# Altium schematic sheet DRV5032DULPGM.SchDoc
size A; SheetNumber: 18; SheetTotal: 20
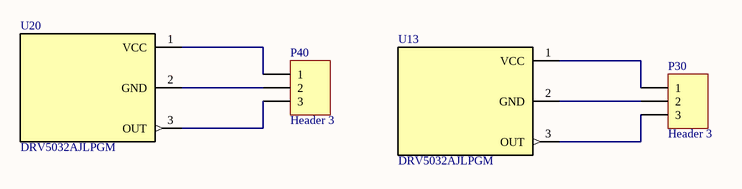
[diagram p0: DRV5032DULPGM.SchDoc]

## Parts
P30  Header 3  [HDR1X3]
P40  Header 3  [HDR1X3]
U13  DRV5032AJLPGM  [SENSOR_DRV5055A2QLPGM]
U20  DRV5032AJLPGM  [SENSOR_DRV5055A2QLPGM]

## Nets
NetP30_1: P30.1 U13.1(VCC)
NetP30_2: P30.2 U13.2(GND)
NetP30_3: P30.3 U13.3(OUT)
NetP40_1: P40.1 U20.1(VCC)
NetP40_2: P40.2 U20.2(GND)
NetP40_3: P40.3 U20.3(OUT)

## Library data of the parts
P30 P40 = Header 3: Header, 3-Pin; LatestRevisionDate: 17-Jul-2002; LatestRevisionNote: Re-released for DXP Platform.; Publisher: Altium Limited
U13 U20 = DRV5032AJLPGM: Low power (5 Hz, <1ÂµA), low voltage (up to 5.5V) switch; MF: Texas Instruments; Value: *; MP: DRV5032AJLPGM; Package: TO-92-3 Texas Instruments; Check_prices: https://www.snapeda.com/parts/DRV5032AJLPGM/Texas+Instruments/view-part/?ref=eda; Purchase-URL: https://pricing.snapeda.com/search/part/DRV5032AJLPGM/?ref=eda; Price: None; Availability: In Stock; SnapEDA_Link: https://www.snapeda.com/parts/DRV5032AJLPGM/Texas+Instruments/view-part/?ref=snap